# Altium schematic sheet ECU_AutoRC_MOT_DRIVER_r00.SchDoc
size A4; SheetNumber: 7; SheetTotal: 9
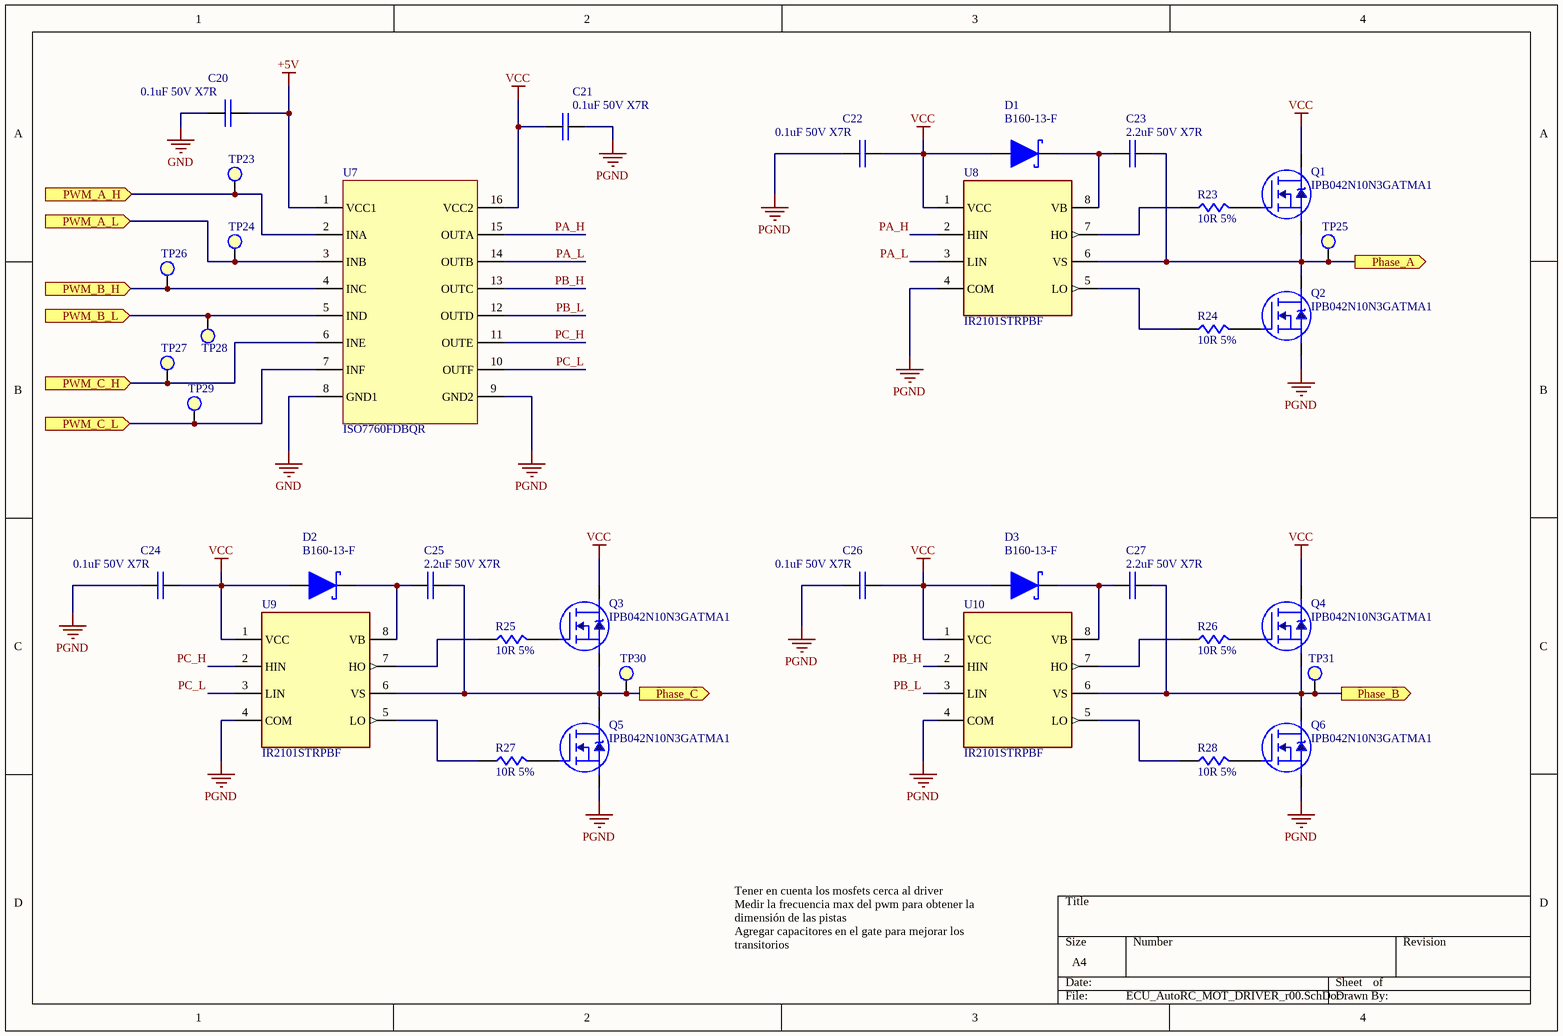
[diagram p0: ECU_AutoRC_MOT_DRIVER_r00.SchDoc]

## Parts
C20  0.1uF 50V X7R  [C_0805]
C21  0.1uF 50V X7R  [C_0805]
C22  0.1uF 50V X7R  [C_0805]
C23  2.2uF 50V X7R  [C_0805]
C24  0.1uF 50V X7R  [C_0805]
C25  2.2uF 50V X7R  [C_0805]
C26  0.1uF 50V X7R  [C_0805]
C27  2.2uF 50V X7R  [C_0805]
D1  B160-13-F  [D_SMA]
D2  B160-13-F  [D_SMA]
D3  B160-13-F  [D_SMA]
Q1  IPB042N10N3GATMA1  [TO263-3]
Q2  IPB042N10N3GATMA1  [TO263-3]
Q3  IPB042N10N3GATMA1  [TO263-3]
Q4  IPB042N10N3GATMA1  [TO263-3]
Q5  IPB042N10N3GATMA1  [TO263-3]
Q6  IPB042N10N3GATMA1  [TO263-3]
R23  10R 5%  [R_0805]
R24  10R 5%  [R_0805]
R25  10R 5%  [R_0805]
R26  10R 5%  [R_0805]
R27  10R 5%  [R_0805]
R28  10R 5%  [R_0805]
TP23  Test Point  [TEST_POINT]  (value not drawn)
TP24  Test Point  [TEST_POINT]  (value not drawn)
TP25  Test Point  [TEST_POINT]  (value not drawn)
TP26  Test Point  [TEST_POINT]  (value not drawn)
TP27  Test Point  [TEST_POINT]  (value not drawn)
TP28  Test Point  [TEST_POINT]  (value not drawn)
TP29  Test Point  [TEST_POINT]  (value not drawn)
TP30  Test Point  [TEST_POINT]  (value not drawn)
TP31  Test Point  [TEST_POINT]  (value not drawn)
U7  ISO7760FDBQR  [IC_SSOP16]
U8  IR2101STRPBF  [IC_8SOIC]
U9  IR2101STRPBF  [IC_8SOIC]
U10  IR2101STRPBF  [IC_8SOIC]

## Ports
Phase_A (out, see ECU_AutoRC_BLK_r00[4C], ECU_AutoRC_MOT_BEMF_r00[1A]), Phase_B (out, see ECU_AutoRC_BLK_r00[4C], ECU_AutoRC_MOT_BEMF_r00[1A]), Phase_C (out, see ECU_AutoRC_BLK_r00[4C], ECU_AutoRC_MOT_BEMF_r00[1A]), PWM_A_H (in, see ECU_AutoRC_BLK_r00[4C], ECU_AutoRC_UC1_r00[1B]), PWM_A_L (in, see ECU_AutoRC_BLK_r00[4C], ECU_AutoRC_UC1_r00[1B]), PWM_B_H (in, see ECU_AutoRC_BLK_r00[4C], ECU_AutoRC_UC1_r00[1B]), PWM_B_L (in, see ECU_AutoRC_BLK_r00[4C], ECU_AutoRC_UC1_r00[1B]), PWM_C_H (in, see ECU_AutoRC_BLK_r00[4C], ECU_AutoRC_UC1_r00[1B]), PWM_C_L (in, see ECU_AutoRC_BLK_r00[4C], ECU_AutoRC_UC1_r00[1B])

## Nets
+5V: C20.2 U7.1(VCC1)
GND: C20.1 U7.8(GND1)
PGND: C21.1 C22.1 C24.1 C26.1 Q2.3(SOURCE) Q5.3(SOURCE) Q6.3(SOURCE) U7.9(GND2) U8.4(COM) U9.4(COM) U10.4(COM)
VCC: C21.2 C22.2 C24.2 C26.2 D1.1(Anode) D2.1(Anode) D3.1(Anode) Q1.2(DRAIN) Q3.2(DRAIN) Q4.2(DRAIN) U7.16(VCC2) U8.1(VCC) U9.1(VCC) U10.1(VCC)
PA_H: U7.15(OUTA) U8.2(HIN)
PA_L: U7.14(OUTB) U8.3(LIN)
PB_H: U7.13(OUTC) U10.2(HIN)
PB_L: U7.12(OUTD) U10.3(LIN)
PC_H: U7.11(OUTE) U9.2(HIN)
PC_L: U7.10(OUTF) U9.3(LIN)
Phase_A: C23.2 Q1.3(SOURCE) Q2.2(DRAIN) TP25.1 U8.6(VS) ; port Phase_A
Phase_B: C27.2 Q4.3(SOURCE) Q6.2(DRAIN) TP31.1 U10.6(VS) ; port Phase_B
Phase_C: C25.2 Q3.3(SOURCE) Q5.2(DRAIN) TP30.1 U9.6(VS) ; port Phase_C
PWM_A_H: TP23.1 U7.2(INA) ; port PWM_A_H
PWM_A_L: TP24.1 U7.3(INB) ; port PWM_A_L
PWM_B_H: TP26.1 U7.4(INC) ; port PWM_B_H
PWM_B_L: TP28.1 U7.5(IND) ; port PWM_B_L
PWM_C_H: TP27.1 U7.6(INE) ; port PWM_C_H
PWM_C_L: TP29.1 U7.7(INF) ; port PWM_C_L
NetC23_1: C23.1 D1.2(Catode) U8.8(VB)
NetC25_1: C25.1 D2.2(Catode) U9.8(VB)
NetC27_1: C27.1 D3.2(Catode) U10.8(VB)
NetQ1_1: Q1.1(GATE) R23.2
NetQ2_1: Q2.1(GATE) R24.2
NetQ3_1: Q3.1(GATE) R25.2
NetQ4_1: Q4.1(GATE) R26.2
NetQ5_1: Q5.1(GATE) R27.2
NetQ6_1: Q6.1(GATE) R28.2
NetR23_1: R23.1 U8.7(HO)
NetR24_1: R24.1 U8.5(LO)
NetR25_1: R25.1 U9.7(HO)
NetR26_1: R26.1 U10.7(HO)
NetR27_1: R27.1 U9.5(LO)
NetR28_1: R28.1 U10.5(LO)

## Notes on the sheet
- Tener en cuenta los mosfets cerca al driver
  Medir la frecuencia max del pwm para obtener la dimensión de las pistas
  Agregar capacitores en el gate para mejorar los transitorios

## Library data of the parts
C20-C27 = Capacitor NP: Non Polarizated Capacitor
D1-D3 = Diode_Schottky: Diode Schottky
Q1-Q6 = NMOS: Mosfet N
R23-R28 = Resistor
TP23-TP31 = TestPoint
U7 = ISO7760FDBQR: DGTL ISOLTR 3KV 6CH GP 16-SSOP
U8-U10 = IR2101STRPBF: Half-Bridge Gate Driver IC Non-Inverting 8-SOIC